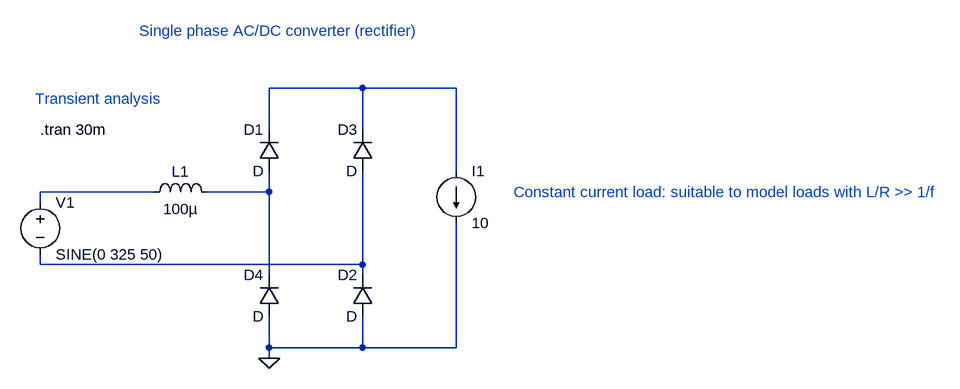
[diagram p0: schematic Single-phase-rectifier-constant-current-load.asc]
Single-phase-rectifier-constant-current-load.asc, the LTspice schematic file:
Version 4.1
SHEET 1 1132 680
WIRE 208 -32 64 -32
WIRE 352 -32 208 -32
WIRE 64 32 64 -32
WIRE 208 32 208 -32
WIRE 352 96 352 -32
WIRE -112 128 -288 128
WIRE 64 128 64 96
WIRE 64 128 -32 128
WIRE -288 144 -288 128
WIRE -288 240 -288 224
WIRE 208 240 208 96
WIRE 208 240 -288 240
WIRE 64 256 64 128
WIRE 208 256 208 240
WIRE 64 368 64 320
WIRE 208 368 208 320
WIRE 208 368 64 368
WIRE 352 368 352 176
WIRE 352 368 208 368
WIRE 64 384 64 368
FLAG 64 384 0
SYMBOL diode 80 96 R180
WINDOW 0 24 64 Left 2
WINDOW 3 24 0 Left 2
SYMATTR InstName D1
SYMBOL diode 224 320 R180
WINDOW 0 24 64 Left 2
WINDOW 3 24 0 Left 2
SYMATTR InstName D2
SYMBOL diode 224 96 R180
WINDOW 0 24 64 Left 2
WINDOW 3 24 0 Left 2
SYMATTR InstName D3
SYMBOL diode 80 320 R180
WINDOW 0 24 64 Left 2
WINDOW 3 24 0 Left 2
SYMATTR InstName D4
SYMBOL voltage -288 128 R0
WINDOW 123 0 0 Left 0
WINDOW 39 0 0 Left 0
SYMATTR InstName V1
SYMATTR Value SINE(0 325 50)
SYMBOL current 352 96 R0
WINDOW 123 0 0 Left 0
WINDOW 39 0 0 Left 0
SYMATTR InstName I1
SYMATTR Value 10
SYMBOL ind -128 144 R270
WINDOW 0 32 56 VTop 2
WINDOW 3 5 56 VBottom 2
SYMATTR InstName L1
SYMATTR Value 100µ
TEXT -288 32 Left 2 !.tran 30m
TEXT -136 -120 Left 2 ;Single phase AC/DC converter (rectifier)
TEXT -296 -16 Left 2 ;Transient analysis
TEXT 440 128 Left 2 ;Constant current load: suitable to model loads with L/R >> 1/f

The netlist it stands for:
* Single-phase-rectifier-constant-current-load.asc
D1 N003 N001 D
D2 0 N004 D
D3 N004 N001 D
D4 0 N003 D
V1 N002 N004 SINE(0 325 50)
I1 N001 0 10
L1 N002 N003 100µ
.model D D
.lib standard.dio
.tran 30m
* Single phase AC/DC converter (rectifier)
* Transient analysis
* Constant current load: suitable to model loads with L/R >> 1/f
.backanno
.end